# Altium schematic sheet vme_can_can.SchDoc: =GlobalProjectName
size 410 x 297 mm; SheetNumber: 2; SheetTotal: 8; PageSetup: Record=PageOptions|CenterHorizontal=True|CenterVertical=True|PrintScale=1.00|XCorrection=1.00|YCorrection=1.00|PrintKind=1|BorderSize=5000000|LeftOffset=0|BottomOffset=0|Orientation=2|PaperLength=1000|PaperWidth=1000|Scale=100|PaperSource=15|PrintQuality=1200|MediaType=1|DitherType=10|PaperKind=A3|PrintScaleMode=1; Weight: -; ScaleFactor: -
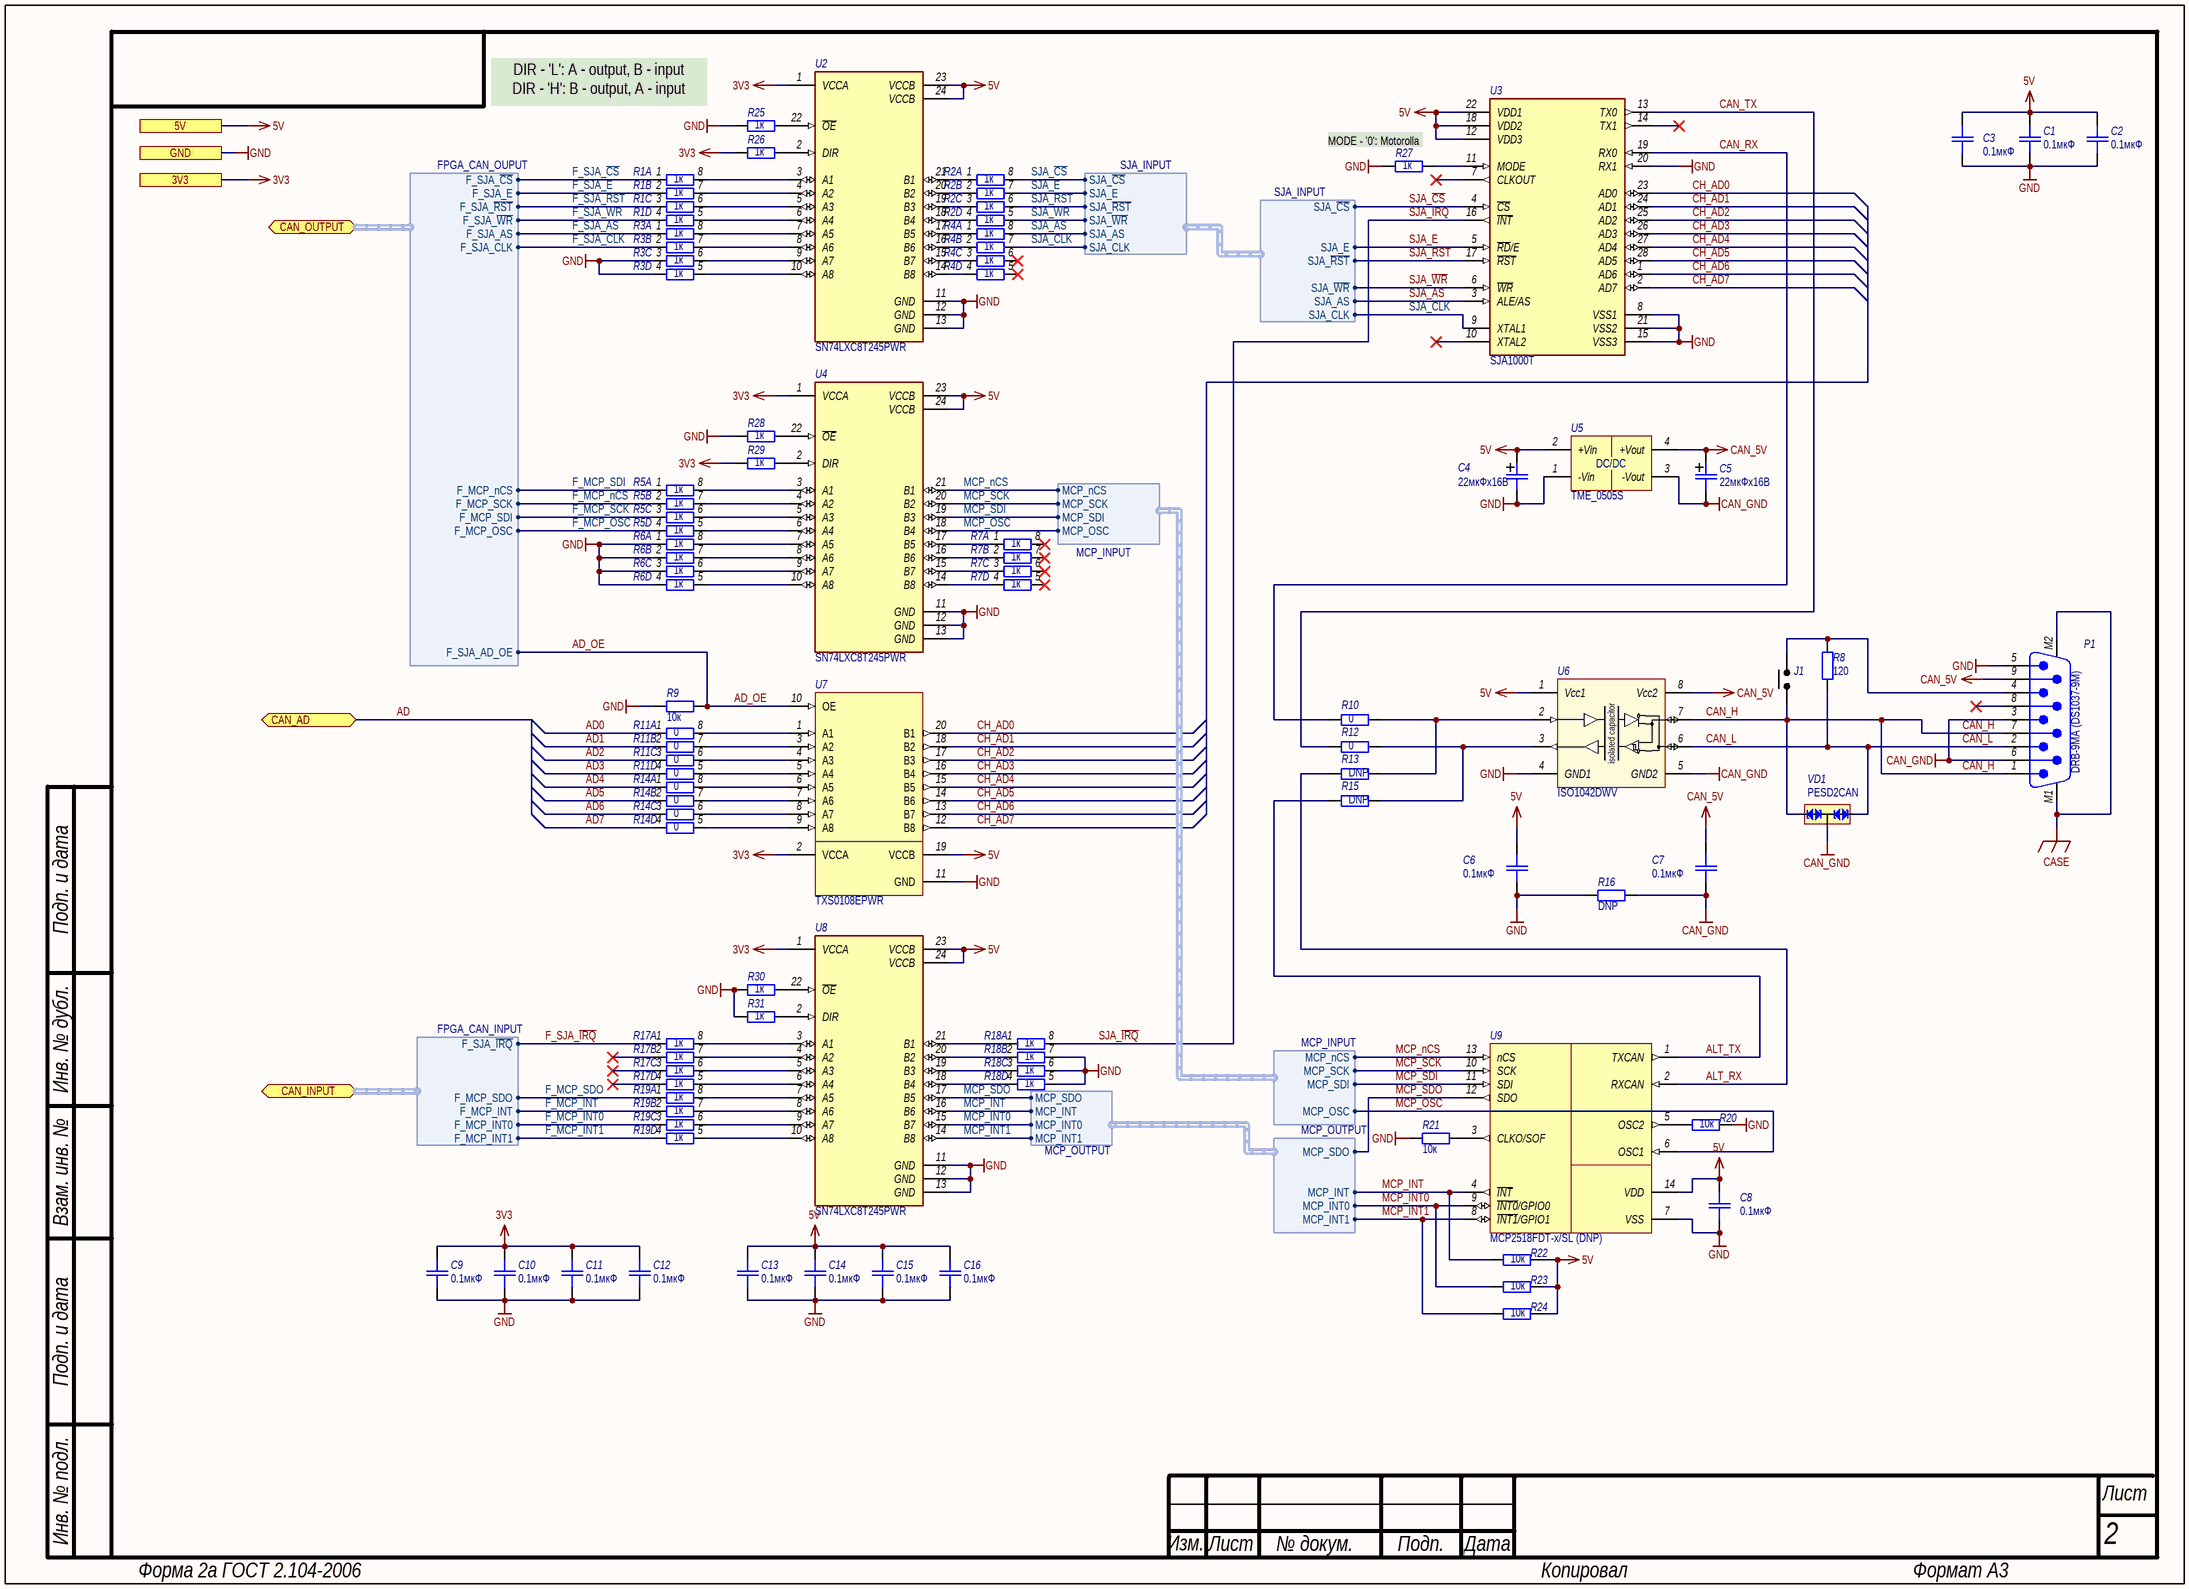
[diagram p0: vme_can_can.SchDoc]

## Parts
C1  0.1мкФ  [SMD_C0805]
C2  0.1мкФ  [SMD_C0805]
C3  0.1мкФ  [SMD_C0805]
C4  value 22мкФх16В  [SMD_size_B]  (hidden comment: OS K53-68)
C5  value 22мкФх16В  [SMD_size_B]  (hidden comment: OS K53-68)
C6  0.1мкФ  [SMD_C0805]
C7  0.1мкФ  [SMD_C0805]
C8  0.1мкФ  [SMD_C0805]
C9  0.1мкФ  [SMD_C0805]
C10  0.1мкФ  [SMD_C0805]
C11  0.1мкФ  [SMD_C0805]
C12  0.1мкФ  [SMD_C0805]
C13  0.1мкФ  [SMD_C0805]
C14  0.1мкФ  [SMD_C0805]
C15  0.1мкФ  [SMD_C0805]
C16  0.1мкФ  [SMD_C0805]
J1  Jumper 2  [PLS-2]  (value not drawn)
P1  Наименование: DRB-9MA (DS1037-9M)  [DRB-9MA]  (hidden comment: DRB-9MA)
R1  value 1к  [TC124]  (hidden comment: 4 Chip Resistor Array)  (parts A,B,C,D of 4)
R2  value 1к  [TC124]  (hidden comment: 4 Chip Resistor Array)  (parts A,B,C,D of 4)
R3  value 1к  [TC124]  (hidden comment: 4 Chip Resistor Array)  (parts A,B,C,D of 4)
R4  value 1к  [TC124]  (hidden comment: 4 Chip Resistor Array)  (parts A,B,C,D of 4)
R5  value 1к  [TC124]  (hidden comment: 4 Chip Resistor Array)  (parts A,B,C,D of 4)
R6  value 1к  [TC124]  (hidden comment: 4 Chip Resistor Array)  (parts A,B,C,D of 4)
R7  value 1к  [TC124]  (hidden comment: 4 Chip Resistor Array)  (parts A,B,C,D of 4)
R8  120  [SMD_0805]
R9  10к  [SMD_0805]
R10  0  [SMD_0805]
R11  value 0  [TC124]  (hidden comment: 4 Chip Resistor Array)  (parts A,B,C,D of 4)
R12  0  [SMD_0805]
R13  DNP  [SMD_0805]
R14  value 0  [TC124]  (hidden comment: 4 Chip Resistor Array)  (parts A,B,C,D of 4)
R15  DNP  [SMD_0805]
R16  DNP  [SMD_0805]
R17  value 1к  [TC124]  (hidden comment: 4 Chip Resistor Array)  (parts A,B,C,D of 4)
R18  value 1к  [TC124]  (hidden comment: 4 Chip Resistor Array)  (parts A,B,C,D of 4)
R19  value 1к  [TC124]  (hidden comment: 4 Chip Resistor Array)  (parts A,B,C,D of 4)
R20  10к  [SMD_0805]
R21  10к  [SMD_0805]
R22  10к  [SMD_0805]
R23  10к  [SMD_0805]
R24  10к  [SMD_0805]
R25  1к  [SMD_0805]
R26  1к  [SMD_0805]
R27  1к  [SMD_0805]
R28  1к  [SMD_0805]
R29  1к  [SMD_0805]
R30  1к  [SMD_0805]
R31  1к  [SMD_0805]
U2  SN74LXC8T245PWR  [TSSOP-24]
U3  SJA1000T  [SO28]
U4  SN74LXC8T245PWR  [TSSOP-24]
U5  TME_0505S  [PCBComponent_1]
U6  Наименование: ISO1042DWV  [SOIC-8-WIDE]  (hidden comment: ISO1042)
U7  TXS0108EPWR  [TSSOP-20]
U8  SN74LXC8T245PWR  [TSSOP-24]
U9  Наименование: MCP2518FDT-x/SL (DNP)  [SOIC-14]  (hidden comment: MCP2518FDT-x/SL)
VD1  PESD2CAN  [SOT-23]

## Ports
3V3, 5V, CAN_AD (bidir), CAN_INPUT (bidir, harness FPGA_CAN_INPUT), CAN_OUTPUT (bidir, harness FPGA_CAN_OUPUT), GND

## Harnesses
SJA_INPUT: SJA_~{CS}, SJA_E, SJA_~{RST}, SJA_~{WR}, SJA_AS, SJA_CLK
MCP_INPUT: MCP_nCS, MCP_SCK, MCP_SDI, MCP_OSC
MCP_OUTPUT: MCP_SDO, MCP_INT, MCP_INT0, MCP_INT1
FPGA_CAN_OUPUT: F_SJA_~{CS}, F_SJA_E, F_SJA_~{RST}, F_SJA_~{WR}, F_SJA_AS, F_MCP_nCS, F_MCP_SCK, F_MCP_SDI, F_SJA_AD_OE, F_MCP_OSC, F_SJA_CLK
FPGA_CAN_INPUT: F_SJA_~{IRQ}, F_MCP_SDO, F_MCP_INT, F_MCP_INT0, F_MCP_INT1

## Nets
3V3: C9.2 C10.2 C11.2 C12.2 R26.2 R29.2 U2.1(VCCA) U4.1(VCCA) U7.2(VCCA) U8.1(VCCA) ; port 3V3
5V: C1.2 C2.2 C3.2 C4.1 C6.2 C8.2 C13.2 C14.2 C15.2 C16.2 R22.1 R23.1 R24.1 U2.23(VCCB) U2.24(VCCB) U3.12(VDD3) U3.18(VDD2) U3.22(VDD1) U4.23(VCCB) U4.24(VCCB) U5.2(+Vin) U6.1(Vcc1) U7.19(VCCB) U8.23(VCCB) U8.24(VCCB) U9.14(VDD) ; port 5V
CAN_5V: C5.1 C7.2 P1.9 U5.4(+Vout) U6.8(Vcc2)
CAN_GND: C5.2 C7.1 P1.3 P1.6 R16.1 U5.3(-Vout) U6.5(GND2) VD1.3(CC)
CASE: P1.M1 P1.M2
GND: C1.1 C2.1 C3.1 C4.2 C6.1 C8.1 C9.1 C10.1 C11.1 C12.1 C13.1 C14.1 C15.1 C16.1 P1.5 R3.3 R3.4 R6.1 R6.2 R6.3 R6.4 R9.2 R16.2 R18.5 R18.6 R18.7 R20.1 R21.1 R25.2 R27.2 R28.2 R30.2 R31.2 U2.11(GND) U2.12(GND) U2.13(GND) U3.8(VSS1) U3.15(VSS3) U3.20(RX1) U3.21(VSS2) U4.11(GND) U4.12(GND) U4.13(GND) U5.1(-Vin) U6.4(GND1) U7.11(GND) U8.11(GND) U8.12(GND) U8.13(GND) U9.7(VSS) ; port GND
AD0: R11.1
AD1: R11.2
AD2: R11.3
AD3: R11.4
AD4: R14.1
AD5: R14.2
AD6: R14.3
AD7: R14.4
AD_OE: R9.1 U7.10(OE) ; port CAN_OUTPUT.F_SJA_AD_OE
ALT_RX: R13.2 U9.2(RXCAN)
ALT_TX: R15.2 U9.1(TXCAN)
CAN_H: J1.1 P1.1 P1.7 U6.7(CANH) VD1.2(C2)
CAN_L: P1.2 R8.1 U6.6(CANL) VD1.1(C1)
CAN_RX: R10.2 U3.19(RX0)
CAN_TX: R12.2 U3.13(TX0)
CH_AD0: U3.23(AD0) U7.20(B1)
CH_AD1: U3.24(AD1) U7.18(B2)
CH_AD2: U3.25(AD2) U7.17(B3)
CH_AD3: U3.26(AD3) U7.16(B4)
CH_AD4: U3.27(AD4) U7.15(B5)
CH_AD5: U3.28(AD5) U7.14(B6)
CH_AD6: U3.1(AD6) U7.13(B7)
CH_AD7: U3.2(AD7) U7.12(B8)
F_MCP_INT: R19.2 ; port CAN_INPUT.F_MCP_INT
F_MCP_INT0: R19.3 ; port CAN_INPUT.F_MCP_INT0
F_MCP_INT1: R19.4 ; port CAN_INPUT.F_MCP_INT1
F_MCP_nCS: R5.2 ; port CAN_OUTPUT.F_MCP_SCK
F_MCP_OSC: R5.4 ; port CAN_OUTPUT.F_MCP_OSC
F_MCP_SCK: R5.3 ; port CAN_OUTPUT.F_MCP_SDI
F_MCP_SDI: R5.1 ; port CAN_OUTPUT.F_MCP_nCS
F_MCP_SDO: R19.1 ; port CAN_INPUT.F_MCP_SDO
F_SJA_AS: R3.1 ; port CAN_OUTPUT.F_SJA_AS
F_SJA_~{CS}: R1.1 ; port CAN_OUTPUT.F_SJA_~{CS}
F_SJA_CLK: R3.2 ; port CAN_OUTPUT.F_SJA_CLK
F_SJA_E: R1.2 ; port CAN_OUTPUT.F_SJA_E
F_SJA_~{IRQ}: R17.1 ; port CAN_INPUT.F_SJA_~{IRQ}
F_SJA_~{RST}: R1.3 ; port CAN_OUTPUT.F_SJA_~{RST}
F_SJA_~{WR}: R1.4 ; port CAN_OUTPUT.F_SJA_~{WR}
MCP_INT: R22.2 U8.16(B6) U9.4(~{INT}) ; harness MCP_OUTPUT.MCP_INT
MCP_INT0: R23.2 U8.15(B7) U9.9(~{INT0}/GPIO0) ; harness MCP_OUTPUT.MCP_INT0
MCP_INT1: R24.2 U8.14(B8) U9.8(~{INT1}/GPIO1) ; harness MCP_OUTPUT.MCP_INT1
MCP_nCS: U4.21(B1) U9.13(nCS) ; harness MCP_INPUT.MCP_nCS
MCP_OSC: U4.18(B4) U9.6(OSC1) ; harness MCP_INPUT.MCP_OSC
MCP_SCK: U4.20(B2) U9.10(SCK) ; harness MCP_INPUT.MCP_SCK
MCP_SDI: U4.19(B3) U9.11(SDI) ; harness MCP_INPUT.MCP_SDI
MCP_SDO: U8.17(B5) U9.12(SDO) ; harness MCP_OUTPUT.MCP_SDO
SJA_AS: R4.8 U3.3(ALE/AS) ; harness SJA_INPUT.SJA_AS
SJA_~{CS}: R2.8 U3.4(~{CS}) ; harness SJA_INPUT.SJA_~{CS}
SJA_CLK: R4.7 U3.9(XTAL1) ; harness SJA_INPUT.SJA_CLK
SJA_E: R2.7 U3.5(~{RD}/E) ; harness SJA_INPUT.SJA_E
SJA_~{IRQ}: R18.8 U3.16(~{INT})
SJA_~{RST}: R2.6 U3.17(~{RST}) ; harness SJA_INPUT.SJA_~{RST}
SJA_~{WR}: R2.5 U3.6(~{WR}) ; harness SJA_INPUT.SJA_~{WR}
NetJ1_2: J1.2 P1.4 R8.2
NetR1_5: R1.5 U2.6(A4)
NetR1_6: R1.6 U2.5(A3)
NetR1_7: R1.7 U2.4(A2)
NetR1_8: R1.8 U2.3(A1)
NetR2_1: R2.1 U2.21(B1)
NetR2_2: R2.2 U2.20(B2)
NetR2_3: R2.3 U2.19(B3)
NetR2_4: R2.4 U2.18(B4)
NetR3_5: R3.5 U2.10(A8)
NetR3_6: R3.6 U2.9(A7)
NetR3_7: R3.7 U2.8(A6)
NetR3_8: R3.8 U2.7(A5)
NetR4_1: R4.1 U2.17(B5)
NetR4_2: R4.2 U2.16(B6)
NetR4_3: R4.3 U2.15(B7)
NetR4_4: R4.4 U2.14(B8)
NetR5_5: R5.5 U4.6(A4)
NetR5_6: R5.6 U4.5(A3)
NetR5_7: R5.7 U4.4(A2)
NetR5_8: R5.8 U4.3(A1)
NetR6_5: R6.5 U4.10(A8)
NetR6_6: R6.6 U4.9(A7)
NetR6_7: R6.7 U4.8(A6)
NetR6_8: R6.8 U4.7(A5)
NetR7_1: R7.1 U4.17(B5)
NetR7_2: R7.2 U4.16(B6)
NetR7_3: R7.3 U4.15(B7)
NetR7_4: R7.4 U4.14(B8)
NetR10_1: R10.1 R13.1 U6.2(TXD)
NetR11_5: R11.5 U7.5(A4)
NetR11_6: R11.6 U7.4(A3)
NetR11_7: R11.7 U7.3(A2)
NetR11_8: R11.8 U7.1(A1)
NetR12_1: R12.1 R15.1 U6.3(RXD)
NetR14_5: R14.5 U7.9(A8)
NetR14_6: R14.6 U7.8(A7)
NetR14_7: R14.7 U7.7(A6)
NetR14_8: R14.8 U7.6(A5)
NetR17_5: R17.5 U8.6(A4)
NetR17_6: R17.6 U8.5(A3)
NetR17_7: R17.7 U8.4(A2)
NetR17_8: R17.8 U8.3(A1)
NetR18_1: R18.1 U8.21(B1)
NetR18_2: R18.2 U8.20(B2)
NetR18_3: R18.3 U8.19(B3)
NetR18_4: R18.4 U8.18(B4)
NetR19_5: R19.5 U8.10(A8)
NetR19_6: R19.6 U8.9(A7)
NetR19_7: R19.7 U8.8(A6)
NetR19_8: R19.8 U8.7(A5)
NetR20_2: R20.2 U9.5(OSC2)
NetR21_2: R21.2 U9.3(CLKO/SOF)
NetR25_1: R25.1 U2.22(~{OE})
NetR26_1: R26.1 U2.2(DIR)
NetR27_1: R27.1 U3.11(MODE)
NetR28_1: R28.1 U4.22(~{OE})
NetR29_1: R29.1 U4.2(DIR)
NetR30_1: R30.1 U8.22(~{OE})
NetR31_1: R31.1 U8.2(DIR)

Not connected (* = marked no-connect by the designer): P1 8*; R4 5* 6*; R7 5* 6* 7* 8*; R17 2* 3* 4*; U3 7(CLKOUT)* 10(XTAL2)* 14(TX1)*

## Buses and harness runs
bus AD = port CAN_AD

## Notes on the sheet
- DIR - 'L': A - output, B - input
  DIR - 'H': B - output, A - input
- (near R27) MODE - '0': Motorolla
- Подп. и дата
- Инв. № дубл.
- Взам. инв. №
- Инв. № подл.
- Изм.
- Лист
- № докум.
- Подп.
- Дата
- Форма 2а ГОСТ 2.104-2006
- Копировал
- Формат А3
- (in symbol ISO1042) isolated capacitor
- (in symbol TME_xxxxS) DC/DC

## Library data of the parts
C1-C3 C6-C16 = Capacitor: Назначение: SMD-конденсатор; Наименование: Конденсатор; Потребление, Вт: 0; Value: 0.1мкФ
C4 C5 = Capacitor_pol: Polarized capacitor; Назначение: Поляризованный SMD-конденсатор; Наименование: Танталовый конденсатор; Потребление, Вт: 0; Точность: %; Напряжение: В; Диэлектрик: *
J1 = Jumper 2: Jumper, 2-Pin, Dual row; Потребление, Вт: 0,0; Наименование: Jumper 2-pin; Назначение: Jumper, 2-Pin, Dual row
P1 = DRB-9MA: D-SUB 9 pins, Male PCB Connector with Hex Screw WR-DSUB, 8.08 mm, Angled; Manufacturer: Wurth Elektronik; Part Number: 618009231221; Working Voltage: 125VAC; Contact Resistance: 30mOhm; Rated Current: 3A; Pin Number: 9; Потребление, Вт: 0.0; Manufacturer URL: http://www.we-online.de; Orientation: Angled; Operating Temperature: -40to85degC; Package Reference: 618009231221; Gender: Male; Mounting Technology: THT; Publisher: WurthElektronik; Datasheet URL: https://katalog.we-online.de/em/datasheet/6180xx231221.pdf; Packaging: Tray; Назначение: D-SUB 9 pins, Male PCB Connector with Hex Screw WR-DSUB, 8.08 mm, Angled; ComponentLink1Description: DataSheet; ComponentLink1URL: http://outer.connfly.group/static/upload/file/pdf/DS1037-02.pdf
R1-R7 R11 R14 R17-R19 = Resistor-4: Потребление, Вт: 0.0; Назначение: 4 Chip Resistor Array; Наименование: 4 Chip Resistor Array
R8-R10 R12 R13 R15 R16 R20-R31 = Resistor: Наименование: Резистор; Назначение: SMD-резистор; Потребление, Вт: 0,001
  R8: Value: 120
  R9 R20-R24: Value: 10к
  R10 R12: Value: 0
  R13 R15 R16: Value: DNP
  R25-R31: Value: 1к
U2 U4 U8 = SN74LXC8T245PWR: Dual-Supply Bus Transceiver with Configurable Level Shifting / and 3-State Outputs; Потрбление, Вт: 0.01; ComponentLink2Description: Datasheet; ComponentLink2URL: http://www.ti.com/lit/ds/symlink/sn74lxc8t245.pdf; Назначение: Dual-Supply Bus Transceiver with Configurable Level Shifting; Наименование: SN74LXC8T245PWR
U3 = SJA1000: IC STAND-ALONE CAN CTRLR 28-SOIC; Manufacturer Part Number: SJA1000T/N1,118; Manufacturer: NXP Semiconductors; Standoff Height: 0.1mm; Interface: Parallel,CAN; Max Supply Voltage: 5.5V; Min Supply Voltage: 4.5V; Nominal Supply Current: 15mA; Потрбление, Вт: 0.075; Ipc Land Pattern Name: SOIC127P1032X265-28; Device Class L2: Interface ICs; Ambient Temperature Range High: +125°C; Temperature Range High: +125°C; Device Class L3: Controllers; Automotive: No; Octopart: https://octopart.com/sja1000t%2Fn1%2C118-nxp+semiconductors-9518151; Height: 2.65mm; Package: SOT136-1; Digikey Description: IC STAND-ALONE CAN CTRLR 28-SOIC; ComponentLink2Description: Datasheet; Footprint Url: https://www.nxp.com/docs/en/package-information/SOT136-1.pdf; Device Class L1: Integrated Circuits (ICs); ComponentLink2URL: https://www.nxp.com/docs/en/data-sheet/SJA1000.pdf; Lead Free: Yes; RoHS: TRUE; Category: IC; Mouser Description: Network Controller & Processor ICs STAND ALONE CAN; Temperature: -40°C to +125°C; Ambient Temperature Range Low: -40°C; Temperature Range Low: -40°C; Назначение: IC STAND-ALONE CAN CTRLR 28-SOIC; Наименование: SJA1000T
U5 = TME_xxxxS: DC-DC, 1W, Fixed input voltage, isolated & unregulated single output; Потребление, Вт: 0.2; Назначение: DC-DC, 1W, Fixed input voltage, isolated & unregulated single output; ComponentLink1Description: DataSheet; ComponentLink1URL: https://static.chipdip.ru/lib/672/DOC011672083.pdf; Supplier 1: Digi-Key; Supplier Part Number 1: 1951-2746-ND; Наименование: TME_0505S
U6 = ISO1042: Isolated CAN Transceiver; Назначение: Изолированный CAN приемник; Потребление, Вт: 0,001; ComponentLink1Description: DataSheet; ComponentLink1URL: https://www.ti.com/lit/ds/symlink/iso1042.pdf?ts=1596792765962&ref_url=https%253A%252F%252Fwww.ti.com%252Fproduct%252FISO1042
U7 = TXS0108EPWR: 8-Bit Bi-directional, Level-Shifting, Voltage Translator / for Open-Drain and Push-Pull Applications; Потребление, Вт: 0.001; Назначение: 8-Bit Bi-directional, Level-Shifting, Voltage Translator; ComponentLink1Description: DataSheet; ComponentLink1URL: https://www.ti.com/lit/ds/symlink/txs0108e.pdf?ts=1638170700951&ref_url=https%253A%252F%252Fwww.google.ru%252F; Наименование: TXS0108EPWR
U9 = MCP2518FDT-x_SL: CAN FD Controller with SPI Interface; Потрбление, Вт: 0.1; Назначение: CAN FD Controller with SPI Interface; ComponentLink1Description: DataSheet; ComponentLink1URL: https://ww1.microchip.com/downloads/en/DeviceDoc/External-CAN-FD-Controller-with-SPI-Interface-DS20006027B.pdf
VD1 = PESD2CAN: CAN bus ESD protection diode; Назначение: Защитная диодная сборка CAN-шины от ЭСР; Потребление, Вт: 0,001; ComponentLink1Description: DataSheet; ComponentLink1URL: https://docviewer.yandex.ru/view/20572601/?*=RQqn8Wj9g8uNyA%2Fh5vLXNATrwhl7InVybCI6Imh0dHBzOi8vYXNzZXRzLm5leHBlcmlhLmNvbS9kb2N1bWVudHMvZGF0YS1zaGVldC9QRVNEMkNBTi5wZGYiLCJ0aXRsZSI6IlBFU0QyQ0FOLnBkZiIsIm5vaWZyYW1lIjp0cnVlLCJ1aWQiOiIyMDU3MjYwMSIsInRzIjoxNTk2Nzk0OTE4Njc4LCJ5dSI6Ijg4OTA2MTMzMTU0MzM4NzEyMSIsInNlcnBQYXJhbXMiOiJsYW5nPWVuJnRtPTE1OTY3OTQ4OTAmdGxkPXJ1Jm5hbWU9UEVTRDJDQU4ucGRmJnRleHQ9cGVzZDJjYW4mdXJsPWh0dHBzJTNBLy9hc3NldHMubmV4cGVyaWEuY29tL2RvY3VtZW50cy9kYXRhLXNoZWV0L1BFU0QyQ0FOLnBkZiZscj02NSZtaW1lPXBkZiZsMTBuPXJ1JnNpZ249MzE3ZjE4NzU1MTcwMWNmYmI4ZDQxYzc2OTNlYTFkYzIma2V5bm89MCJ9&lang=en; Наименование: PESD2CAN